# Altium project TabajdiMáté19.PrjPcb
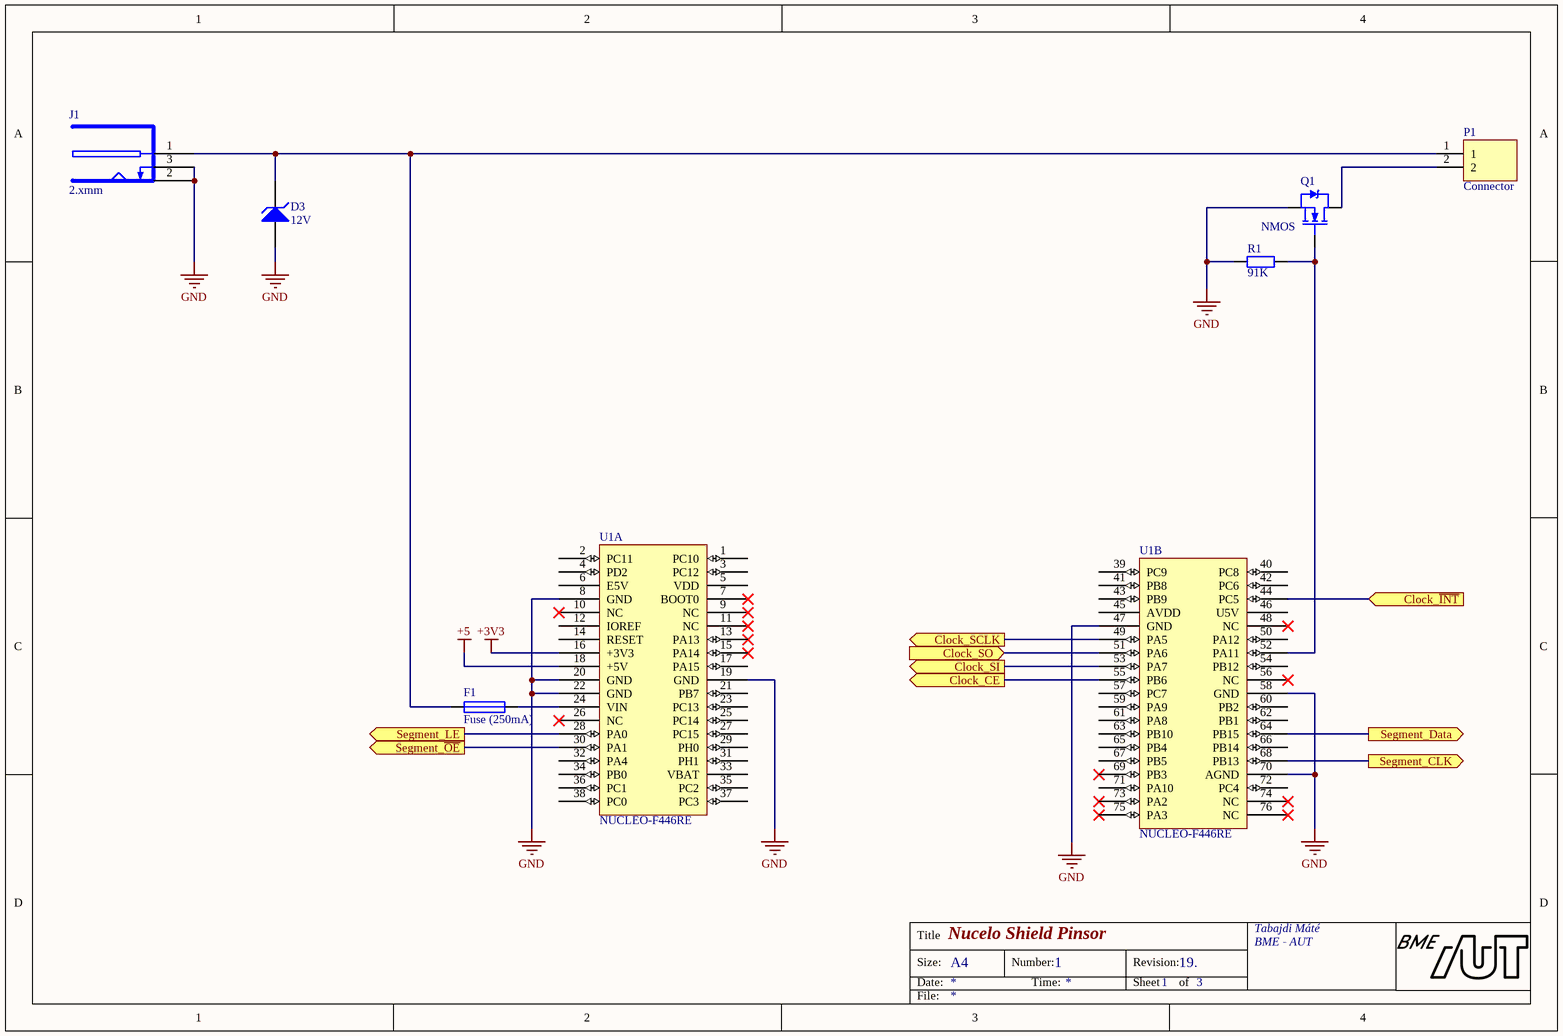
[diagram p0: Nucleo.SchDoc]
3 sheets, 29 parts. Net scope: flat (ports and power ports of the same name join across sheets).
Board file: hazi_kiindulas.PcbDoc
Sheets:
  Nucleo.SchDoc
  Clock.SchDoc
  Display.SchDoc

## Sheet Nucleo.SchDoc: Nucelo Shield Pinsor
size A4; Author: Tabajdi Máté; Organization: BME - AUT; DocumentNumber: 1; Revision: 19.; SheetNumber: 1; SheetTotal: 3

### Parts
D3  12V  [FP_SOD323-F]
F1  Fuse (250mA)  [FP_MULTIFUSE]
J1  2.xmm  [FP_DC_TAP_ANYA]
P1  Connector  [FP_CONN2_TUSKE_254MM]
Q1  NMOS  [FP_SOT23-3]
R1  91K  [FP_0805_RES]
U1  NUCLEO-F446RE  [FP_NUCLEO-64_2x20]  (parts A,B of 2)

### Ports
Clock_CE (out), Clock_SCLK (out), Clock_SI (out), Clock_SO (in), Clock_~{INT} (in), Segment_CLK (out), Segment_Data (out), Segment_LE (out), Segment_~{OE} (out)

### Nets
+3V3: U1.16(+3V3)
+5: U1.18(+5V)
GND: D3.1(A) J1.2(SLEEVE) J1.3(BREAK) Q1.3(S) R1.1 U1.8(GND) U1.19(GND) U1.20(GND) U1.22(GND) U1.47(GND) U1.58(GND) U1.70(AGND)
Segment_CLK: U1.68(PB13) ; port Segment_CLK
Segment_LE: U1.28(PA0) ; port Segment_LE
Segment_~{OE}: U1.30(PA1) ; port Segment_~{OE}
NetD3_2: D3.2(K) F1.1 J1.1(PIN) P1.1
NetF1_2: F1.2 U1.24(VIN)
NetP1_2: P1.2 Q1.2(D)
NetQ1_1: Q1.1(G) R1.2 U1.52(PA11)
NetU1_44: U1.44(PC5) ; port Clock_~{INT}
NetU1_49: U1.49(PA5) ; port Clock_SCLK
NetU1_51: U1.51(PA6) ; port Clock_SO
NetU1_53: U1.53(PA7) ; port Clock_SI
NetU1_55: U1.55(PB6) ; port Clock_CE
NetU1_64: U1.64(PB15) ; port Segment_Data

Not connected (* = marked no-connect by the designer): U1 1(PC10) 2(PC11) 3(PC12) 4(PD2) 5(VDD) 6(E5V) 7(BOOT0)* 9(NC)* 10(NC)* 11(NC)* 12(IOREF) 13(PA13)* 14(RESET) 15(PA14)* 17(PA15) 21(PB7) 23(PC13) 25(PC14) 26(NC)* 27(PC15) 29(PH0) 31(PH1) 32(PA4) 33(VBAT) 34(PB0) 35(PC2) 36(PC1) 37(PC3) 38(PC0) 39(PC9) 40(PC8) 41(PB8) 42(PC6) 43(PB9) 45(AVDD) 46(U5V) 48(NC)* 50(PA12) 54(PB12) 56(NC)* 57(PC7) 59(PA9) 60(PB2) 61(PA8) 62(PB1) 63(PB10) 65(PB4) 66(PB14) 67(PB5) 69(PB3)* 71(PA10) 72(PC4) 73(PA2)* 74(NC)* 75(PA3)* 76(NC)*

### Notes on the sheet
- Title
- Size:
- Date:
- A4
- Number:
- Time:
- Revision:
- Sheet
- of
- File:

### Library data of the parts
D3 = ZENER: Zener Diode; Reference: 2069497; Name: TDZ12J,115 Zener diode; Supplier: Farnell; U_Z: 12V
F1 = Fuse: Reference: 2929331; Name: CC12H250MA-TR Slow Blow Fuse; Supplier: Farnell
J1 = DC_TAP_ANYA: 2.xmm DC HEBA25 TÁPFESZÜLTSÉG ALJZAT ZÁRT, NYÁKBA 90°; Name: TÁP DC ANYA 5.5/2.1/9.5mm DCS-5521-5; Supplier: Lomex; Reference: 43-07-67
P1 = Connector_2pin: 2pin connector; Name: Egysoros tüskesor; Supplier: Tanszéki forrás
Q1 = NMOS: NXP - BSP030,115 - MOSFET, N CH, 30V, 10A, SOT223; pin to pad: 2>3 3>2; Reference: 2061404; Name: DMG3414U power mosfet; Supplier: Farnell
R1 = RES: Resistor; Tolerance: 5%; Power: 0.125W; Name: 91K0 0805 5% CR-05JL7---91K 0.125W (VIK); Supplier: Lomex; Reference: 81-35-12; Value: 91K
U1 = NUCLEO-F446RE: Reference: NUCLEO; Name: Nucleo F446RE; Supplier: Tanszék

## Sheet Clock.SchDoc: Valós idejű óra
size A4; Author: Tabajdi Máté; Organization: BME - AUT; DocumentNumber: 2; Revision: 19.; SheetNumber: 2; SheetTotal: 3
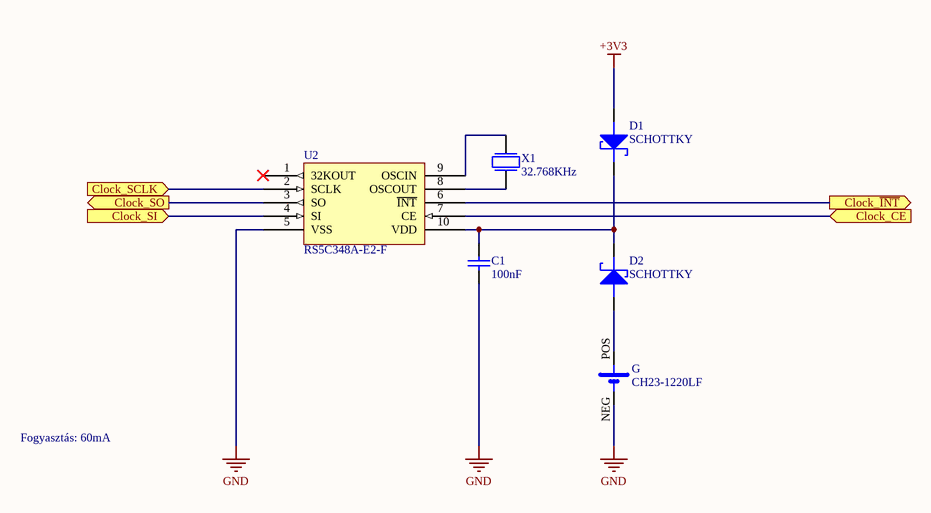
[diagram p1: Clock.SchDoc]

### Parts
C1  100nF  [FP_0805_CAP_085]
D1  SCHOTTKY  [FP_SOD323-F]
D2  SCHOTTKY  [FP_SOD323-F]
G  CH23-1220LF  [CH23-1220LF]
U2  RS5C348A-E2-F  [TSSOP50P640X135-10M]
X1  32.768KHz  [NXG 2x6 footprint]

### Ports
Clock_CE (in), Clock_SCLK (in), Clock_SI (in), Clock_SO (out), Clock_~{INT} (out)

### Nets
+3V3: D1.1(ANODE)
GND: C1.1 G.NEG U2.5(VSS)
NetC1_2: C1.2 D1.2(CATHODE) D2.2(CATHODE) U2.10(VDD)
NetD2_1: D2.1(ANODE) G.POS
NetU1_44: U2.6(~{INT}) ; port Clock_~{INT}
NetU1_49: U2.2(SCLK) ; port Clock_SCLK
NetU1_51: U2.3(SO) ; port Clock_SO
NetU1_53: U2.4(SI) ; port Clock_SI
NetU1_55: U2.7(CE) ; port Clock_CE
NetU2_8: U2.8(OSCOUT) X1.2
NetU2_9: U2.9(OSCIN) X1.1

Not connected (* = marked no-connect by the designer): U2 1(32KOUT)*

### Notes on the sheet
- Fogyasztás: 60mA
- Title
- Size:
- Date:
- A4
- Number:
- Time:
- Revision:
- Sheet
- of
- File:

### Library data of the parts
C1 = CAP: Capacitor; Tolerance: 10%; Voltage: 50V; Name: 100nF 0805 10% 50V X7R 0805B104K500NT (FNG); Supplier: Lomex; Reference: 82-13-46; Value: 100nF
D1 D2 = SCHOTTKY: Schottky diode; Reference: 1972726; Name: PMEG6002EJ,115 Schottky Rectifier; Supplier: Farnell
G = CH23-1220LF: BATTERY HOLDER, DIP, 12MM; Accessory Type: Coin Cell Battery Holder; For Use With: 1220 Coin Cell Batteries; Battery ...; Value: 3V; MF: Multicomp; Reference: 2064721; Name: CH23-1220LF elemtartó; Price: None; Package: None; Availability: Unavailable; MP: CH23-1220LF; SnapEDA_Link: https://www.snapeda.com/parts/CH23-1220LF/Multicomp/view-part/575172/?ref=snap; Supplier: Farnell
U2 = RS5C348A-E2-F: Real-time clock; Reference: RIC011; Supplier: ChipCAD; Name: RS5C348A-E2-F
X1 = Crystal: Quarz Crystal; Name: 32.768kHz QUARZ D=2x6mm NXG (NSK) DT-26 ˝20ppm 12.5pF ORAQUARZ; Value: 32.768KHz; Reference: 40-00-51; Supplier: Lomex

## Sheet Display.SchDoc: 7 szegmenses kijelző
size A4; Author: Tabajdi Máté; Organization: BME - AUT; DocumentNumber: 3; Revision: 19.; SheetNumber: 3; SheetTotal: 3
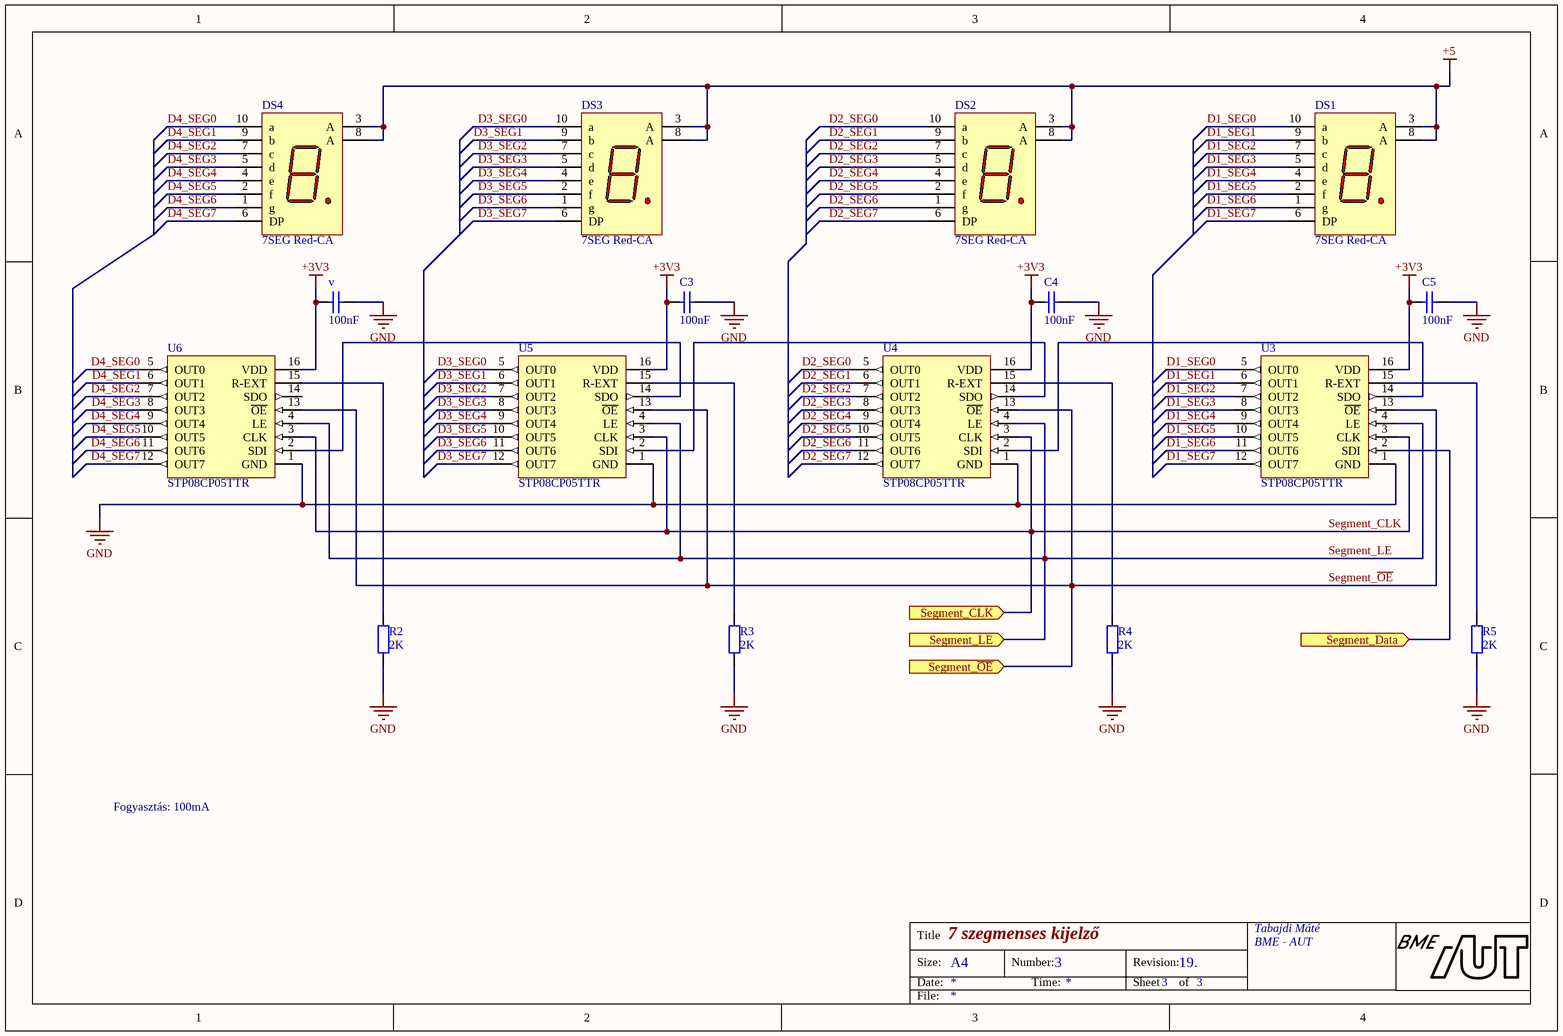
[diagram p2: Display.SchDoc]

### Parts
C3  100nF  [FP_0805_CAP_085]
C4  100nF  [FP_0805_CAP_085]
C5  100nF  [FP_0805_CAP_085]
DS1  7SEG Red-CA  [FP_7SEG]
DS2  7SEG Red-CA  [FP_7SEG]
DS3  7SEG Red-CA  [FP_7SEG]
DS4  7SEG Red-CA  [FP_7SEG]
R2  2K  [FP_0805_RES]
R3  2K  [FP_0805_RES]
R4  2K  [FP_0805_RES]
R5  2K  [FP_0805_RES]
U3  STP08CP05TTR  [TSOP65P640X120-16M]
U4  STP08CP05TTR  [TSOP65P640X120-16M]
U5  STP08CP05TTR  [TSOP65P640X120-16M]
U6  STP08CP05TTR  [TSOP65P640X120-16M]
v  100nF  [FP_0805_CAP_085]

### Ports
Segment_CLK (in), Segment_Data (in), Segment_LE (in), Segment_~{OE} (in)

### Nets
+3V3: C3.2 C4.2 C5.2 U3.16(VDD) U4.16(VDD) U5.16(VDD) U6.16(VDD) v.2
+5: DS1.3(A) DS1.8(A) DS2.3(A) DS2.8(A) DS3.3(A) DS3.8(A) DS4.3(A) DS4.8(A)
GND: C3.1 C4.1 C5.1 R2.1 R3.1 R4.1 R5.1 U3.1(GND) U4.1(GND) U5.1(GND) U6.1(GND) v.1
D1_SEG0: DS1.10(a) U3.5(OUT0)
D1_SEG1: DS1.9(b) U3.6(OUT1)
D1_SEG2: DS1.7(c) U3.7(OUT2)
D1_SEG3: DS1.5(d) U3.8(OUT3)
D1_SEG4: DS1.4(e) U3.9(OUT4)
D1_SEG5: DS1.2(f) U3.10(OUT5)
D1_SEG6: DS1.1(g) U3.11(OUT6)
D1_SEG7: DS1.6(DP) U3.12(OUT7)
D2_SEG0: DS2.10(a) U4.5(OUT0)
D2_SEG1: DS2.9(b) U4.6(OUT1)
D2_SEG2: DS2.7(c) U4.7(OUT2)
D2_SEG3: DS2.5(d) U4.8(OUT3)
D2_SEG4: DS2.4(e) U4.9(OUT4)
D2_SEG5: DS2.2(f) U4.10(OUT5)
D2_SEG6: DS2.1(g) U4.11(OUT6)
D2_SEG7: DS2.6(DP) U4.12(OUT7)
D3_SEG0: DS3.10(a) U5.5(OUT0)
D3_SEG1: DS3.9(b) U5.6(OUT1)
D3_SEG2: DS3.7(c) U5.7(OUT2)
D3_SEG3: DS3.5(d) U5.8(OUT3)
D3_SEG4: DS3.4(e) U5.9(OUT4)
D3_SEG5: DS3.2(f) U5.10(OUT5)
D3_SEG6: DS3.1(g) U5.11(OUT6)
D3_SEG7: DS3.6(DP) U5.12(OUT7)
D4_SEG0: DS4.10(a) U6.5(OUT0)
D4_SEG1: DS4.9(b) U6.6(OUT1)
D4_SEG2: DS4.7(c) U6.7(OUT2)
D4_SEG3: DS4.5(d) U6.8(OUT3)
D4_SEG4: DS4.4(e) U6.9(OUT4)
D4_SEG5: DS4.2(f) U6.10(OUT5)
D4_SEG6: DS4.1(g) U6.11(OUT6)
D4_SEG7: DS4.6(DP) U6.12(OUT7)
Segment_CLK: U3.3(CLK) U4.3(CLK) U5.3(CLK) U6.3(CLK) ; port Segment_CLK
Segment_LE: U3.4(LE) U4.4(LE) U5.4(LE) U6.4(LE) ; port Segment_LE
Segment_~{OE}: U3.13(~{OE}) U4.13(~{OE}) U5.13(~{OE}) U6.13(~{OE}) ; port Segment_~{OE}
NetR2_2: R2.2 U6.15(R-EXT)
NetR3_2: R3.2 U5.15(R-EXT)
NetR4_2: R4.2 U4.15(R-EXT)
NetR5_2: R5.2 U3.15(R-EXT)
NetU1_64: U3.2(SDI) ; port Segment_Data
NetU3_14: U3.14(SDO) U4.2(SDI)
NetU4_14: U4.14(SDO) U5.2(SDI)
NetU5_14: U5.14(SDO) U6.2(SDI)

Not connected (* = marked no-connect by the designer): U6 14(SDO)

### Notes on the sheet
- Fogyasztás: 100mA
- Title
- Size:
- Date:
- A4
- Number:
- Time:
- Revision:
- Sheet
- of
- File:

### Library data of the parts
C3-C5 v = CAP: as C1 on sheet Clock; Supplier: Lomex; Reference: 82-13-46; Value: 100nF
DS1 = 7SEG Red-CA: 7-Segment Display: CA, RH DP; MinimumIntensity: 360 ucd; Note: IF = 5 mA; Colour: High Efficiency Red (HER); Note: Pins 1 and 6 are redundant Anodes.; Name: FYS-3911BUHR-21; Parameter 1: FYS-3911BUHR-21 (FYL) 7 SEG SRED COM.AN. 10mm 30mcd 10x13x7mm 640nm; Published: 8-Jun-2000; LatestRevisionDate: 17-Dec-2003; LatestRevisionNote: Schematic revised, PCB Footprint replaced.; DatasheetVersion: 19-Feb-2002; PackageVersion: 11-Feb-2002; PackageReference: A; Publisher: Altium Limited; PackageDescription: LED, 7-Segment Display, 7.62 mm, RHD; 10 Leads; Row Space 5.08 mm; Pitch 2.54 mm; ComponentLink1Description: Manufacturer Link; ComponentLink1URL: http://www.agilent.com/; Supplier: Lomex; Reference: 35-03-94
DS2-DS4 = 7SEG Red-CA: 7-Segment Display: CA, RH DP; MinimumIntensity: 360 ucd; Note: IF = 5 mA; Colour: High Efficiency Red (HER); Note: Pins 1 and 6 are redundant Anodes.; Name: FYS-3911BUHR-21 (FYL) 7 SEG SRED COM.AN. 10mm 30mcd 10x13x7mm 640nm; Published: 8-Jun-2000; LatestRevisionDate: 17-Dec-2003; LatestRevisionNote: Schematic revised, PCB Footprint replaced.; DatasheetVersion: 19-Feb-2002; PackageVersion: 11-Feb-2002; PackageReference: A; Publisher: Altium Limited; PackageDescription: LED, 7-Segment Display, 7.62 mm, RHD; 10 Leads; Row Space 5.08 mm; Pitch 2.54 mm; ComponentLink1Description: Manufacturer Link; ComponentLink1URL: http://www.agilent.com/; Supplier: Lomex; Reference: 35-03-94
R2-R5 = RES: Resistor; Tolerance: 5%; Power: 0.125W; Name: 2K00 0805 5% CR-05JL7----2K 0.125W (VIK); Supplier: Lomex; Reference: 81-11-90; Value: 2K
U3-U6 = STP08CP05TTR: Low voltage, low current power 8-bit shift register; Supplier: Tanszéki forrás; Reference: STP08CP05TTR; Name: STP08CP05TTR

## Nets that join several sheets
+3V3: Nucleo (U1.16), Clock (D1.1), Display (8 pins)
+5: Nucleo (U1.18), Display (8 pins)
GND: Nucleo (12 pins), Clock (C1.1 G.NEG U2.5), Display (12 pins)
NetU1_44: Nucleo (U1.44), Clock (U2.6)
NetU1_49: Nucleo (U1.49), Clock (U2.2)
NetU1_51: Nucleo (U1.51), Clock (U2.3)
NetU1_53: Nucleo (U1.53), Clock (U2.4)
NetU1_55: Nucleo (U1.55), Clock (U2.7)
NetU1_64: Nucleo (U1.64), Display (U3.2)
Segment_CLK: Nucleo (U1.68), Display (U3.3 U4.3 U5.3 U6.3)
Segment_LE: Nucleo (U1.28), Display (U3.4 U4.4 U5.4 U6.4)
Segment_~{OE}: Nucleo (U1.30), Display (U3.13 U4.13 U5.13 U6.13)